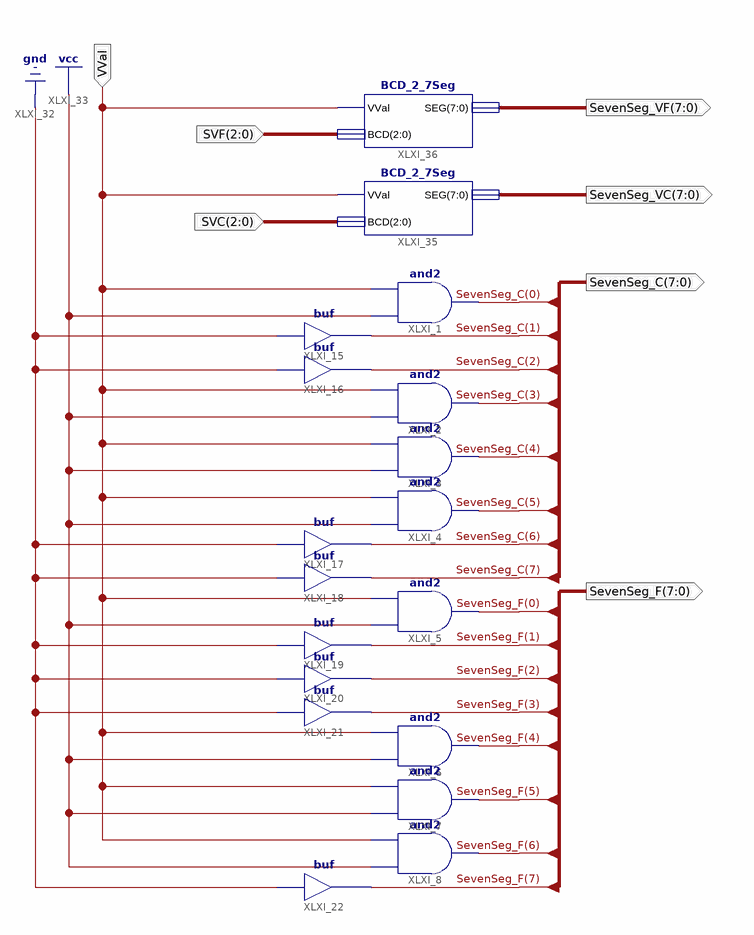
[diagram p0: schematic sheet 1]
// Xilinx ISE schematic Visualiza_Cuenta.sch (spartan6) as structural Verilog: 18 symbols, 7 ports
module Visualiza_Cuenta (
  input  [2:0] SVF,
  input  [2:0] SVC,
  input  VVal,
  output [7:0] SevenSeg_C,
  output [7:0] SevenSeg_F,
  output [7:0] SevenSeg_VC,
  output [7:0] SevenSeg_VF
);

  and XLXI_1 (SevenSeg_C[0], 1'b1, VVal);
  and XLXI_5 (SevenSeg_F[0], 1'b1, VVal);
  buf XLXI_15 (SevenSeg_C[1], 1'b0);
  buf XLXI_16 (SevenSeg_C[2], 1'b0);
  buf XLXI_17 (SevenSeg_C[6], 1'b0);
  buf XLXI_18 (SevenSeg_C[7], 1'b0);
  buf XLXI_19 (SevenSeg_F[1], 1'b0);
  buf XLXI_20 (SevenSeg_F[2], 1'b0);
  buf XLXI_21 (SevenSeg_F[3], 1'b0);
  buf XLXI_22 (SevenSeg_F[7], 1'b0);
  and XLXI_3 (SevenSeg_C[4], 1'b1, VVal);
  and XLXI_2 (SevenSeg_C[3], 1'b1, VVal);
  and XLXI_4 (SevenSeg_C[5], 1'b1, VVal);
  and XLXI_8 (SevenSeg_F[6], 1'b1, VVal);
  and XLXI_7 (SevenSeg_F[5], 1'b1, VVal);
  and XLXI_6 (SevenSeg_F[4], 1'b1, VVal);
  BCD_2_7Seg XLXI_35 (.SEG(SevenSeg_VC), .VVal(VVal), .BCD(SVC));
  BCD_2_7Seg XLXI_36 (.SEG(SevenSeg_VF), .VVal(VVal), .BCD(SVF));
endmodule
